# Altium schematic sheet DSP.SchDoc
size D
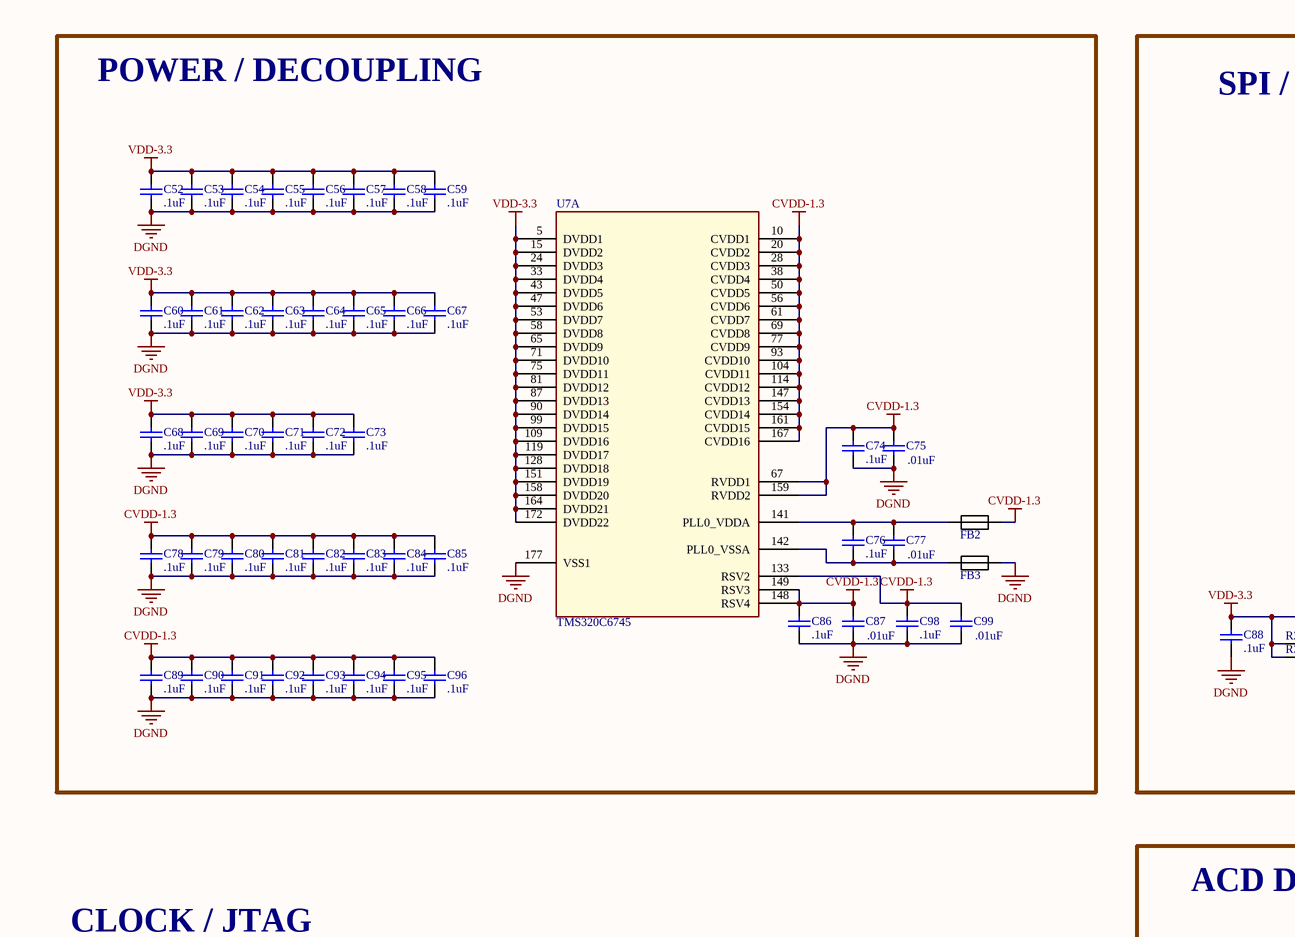
[diagram p0: DSP.SchDoc, top left]
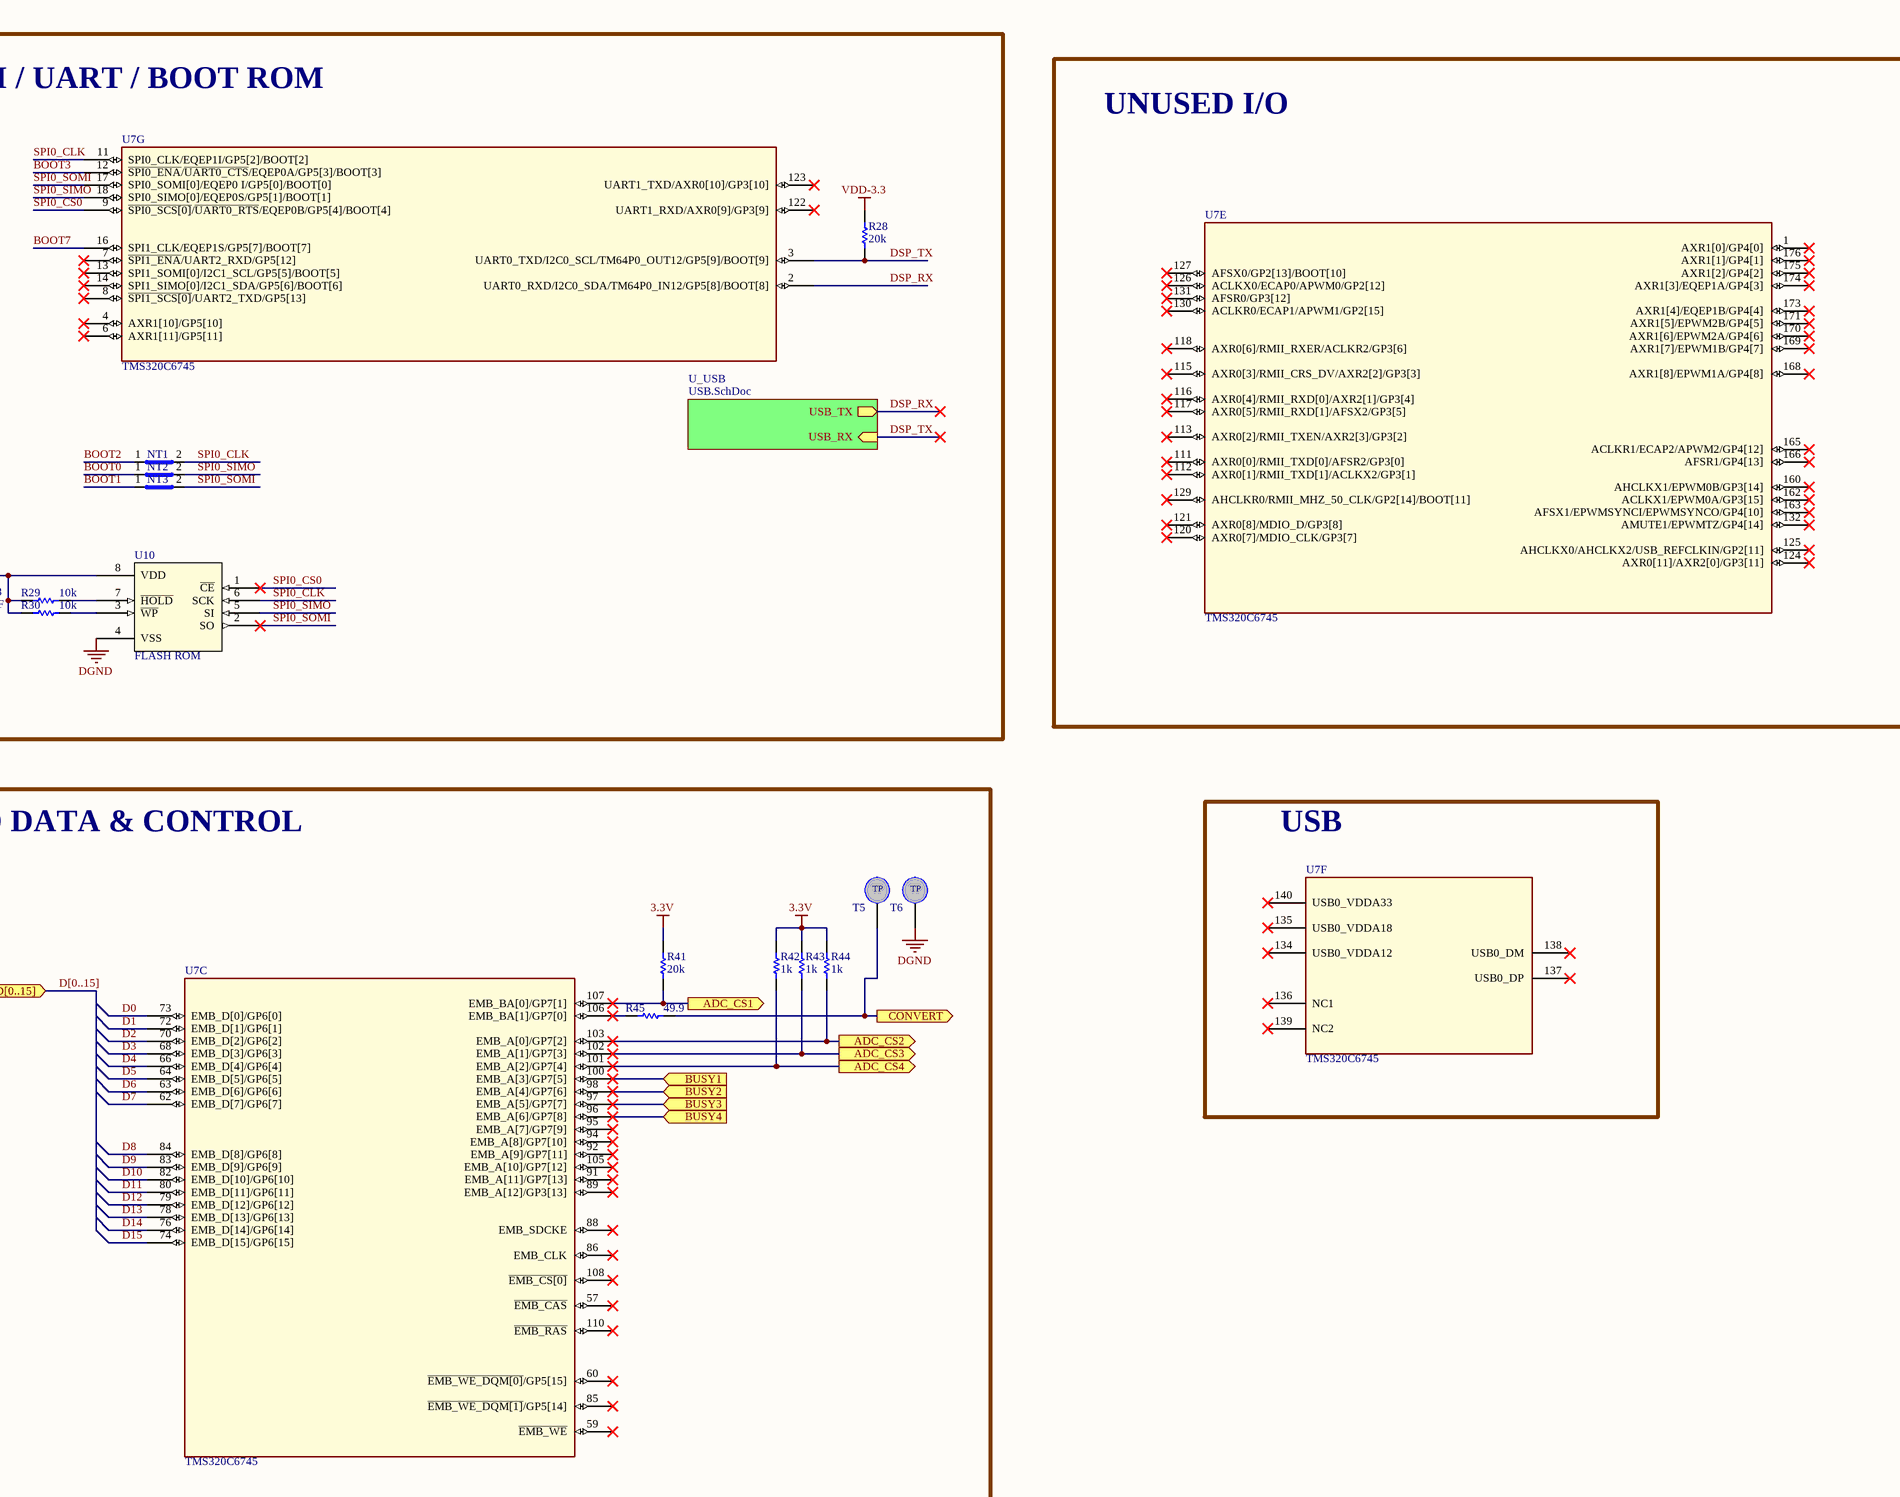
[diagram p1: DSP.SchDoc, top right]
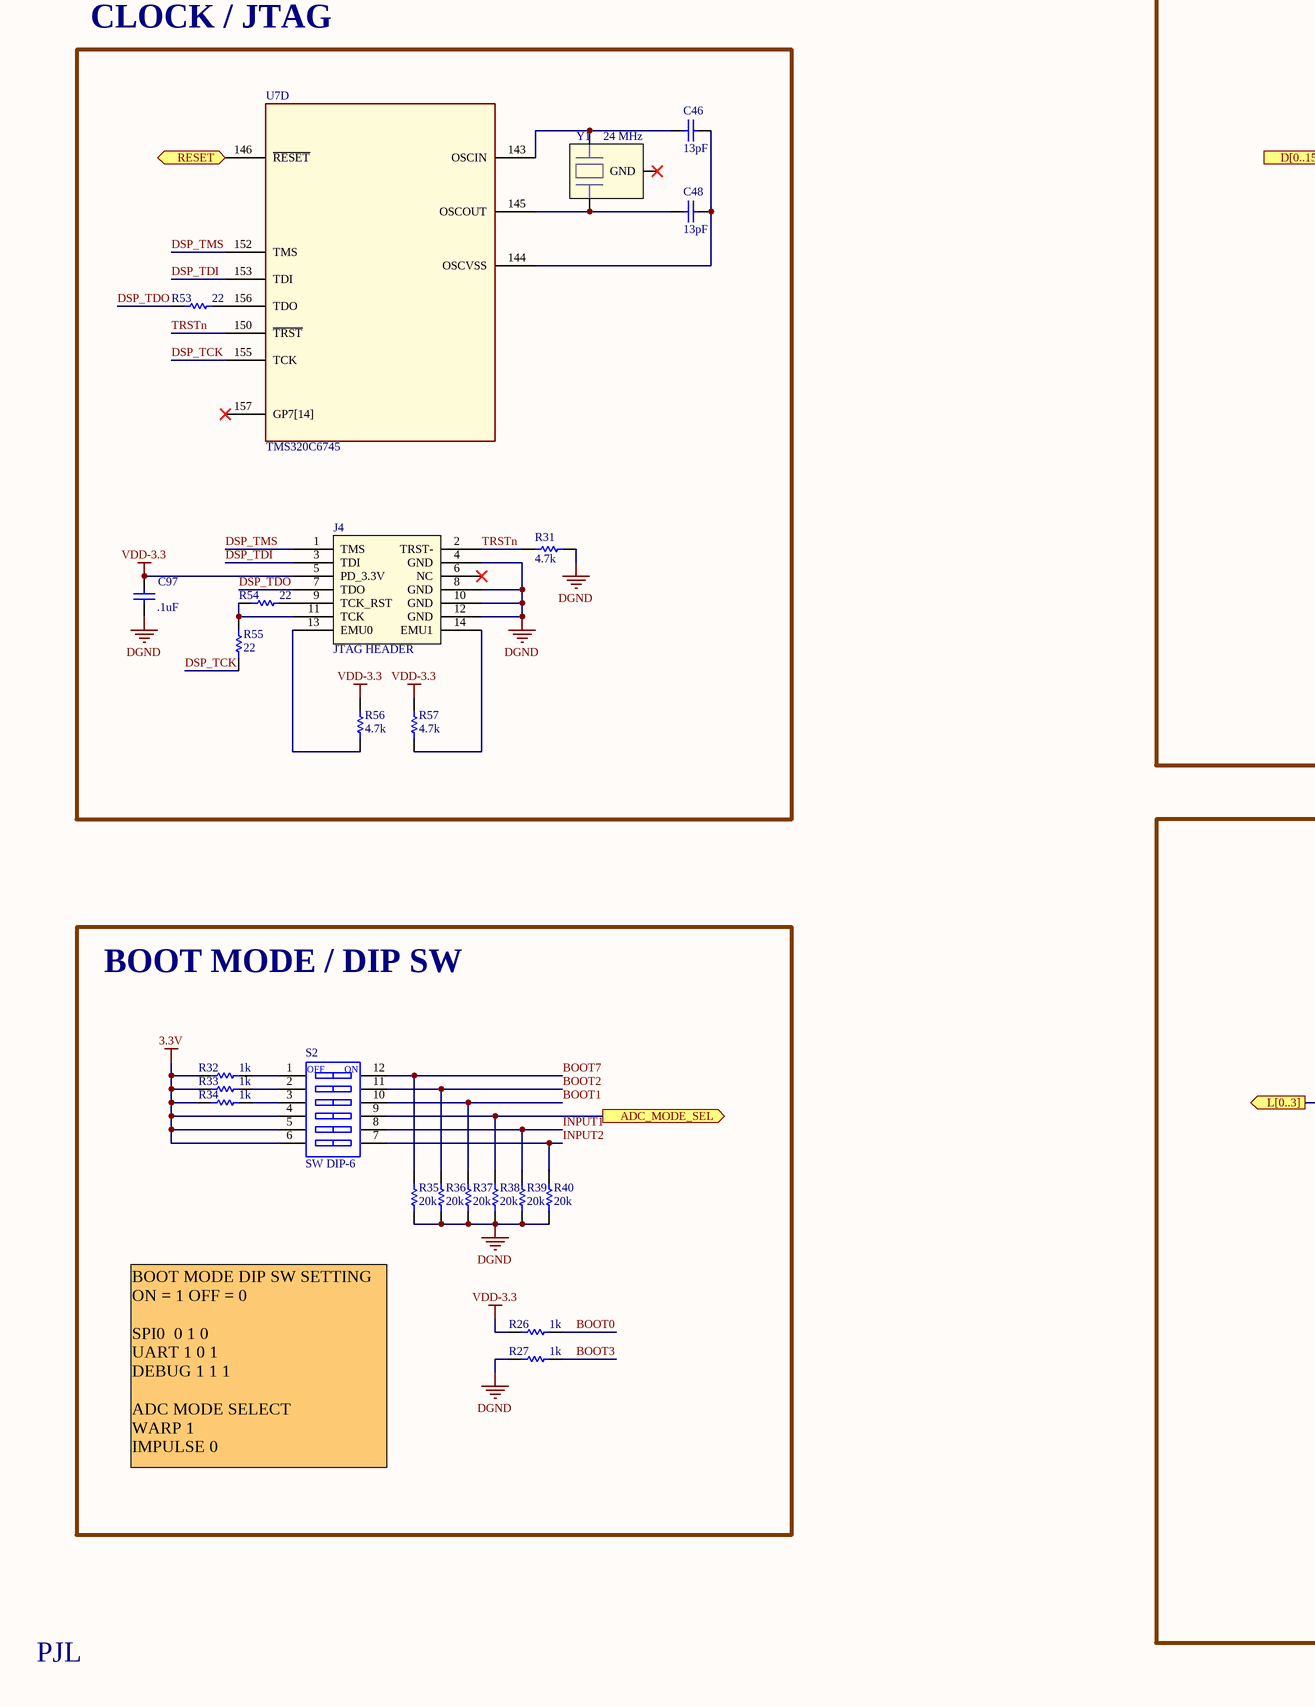
[diagram p2: DSP.SchDoc, bottom left]
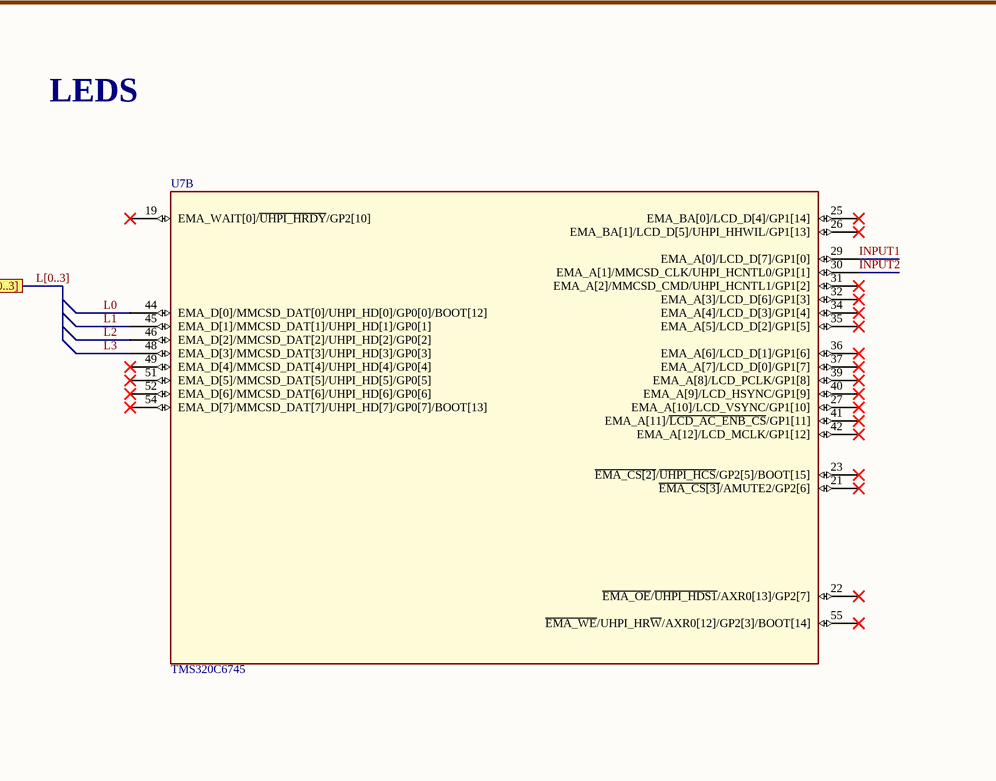
[diagram p3: DSP.SchDoc, bottom right]

## Parts
C46  13pF  [CAPC2012XL]
C48  13pF  [CAPC2012XL]
C52  .1uF  [CAPC1608XN]
C53  .1uF  [CAPC1608XN]
C54  .1uF  [CAPC1608XN]
C55  .1uF  [CAPC1608XN]
C56  .1uF  [CAPC1608XN]
C57  .1uF  [CAPC1608XN]
C58  .1uF  [CAPC1608XN]
C59  .1uF  [CAPC1608XN]
C60  .1uF  [CAPC1608XN]
C61  .1uF  [CAPC1608XN]
C62  .1uF  [CAPC1608XN]
C63  .1uF  [CAPC1608XN]
C64  .1uF  [CAPC1608XN]
C65  .1uF  [CAPC1608XN]
C66  .1uF  [CAPC1608XN]
C67  .1uF  [CAPC1608XN]
C68  .1uF  [CAPC1608XN]
C69  .1uF  [CAPC1608XN]
C70  .1uF  [CAPC1608XN]
C71  .1uF  [CAPC1608XN]
C72  .1uF  [CAPC1608XN]
C73  .1uF  [CAPC1608XN]
C74  .1uF  [CAPC1608XN]
C75  .01uF  [CAPC1608XN]
C76  .1uF  [CAPC1608XN]
C77  .01uF  [CAPC1608XN]
C78  .1uF  [CAPC1608XN]
C79  .1uF  [CAPC1608XN]
C80  .1uF  [CAPC1608XN]
C81  .1uF  [CAPC1608XN]
C82  .1uF  [CAPC1608XN]
C83  .1uF  [CAPC1608XN]
C84  .1uF  [CAPC1608XN]
C85  .1uF  [CAPC1608XN]
C86  .1uF  [CAPC1608XN]
C87  .01uF  [CAPC1608XN]
C88  .1uF  [CAPC1608XN]
C89  .1uF  [CAPC1608XN]
C90  .1uF  [CAPC1608XN]
C91  .1uF  [CAPC1608XN]
C92  .1uF  [CAPC1608XN]
C93  .1uF  [CAPC1608XN]
C94  .1uF  [CAPC1608XN]
C95  .1uF  [CAPC1608XN]
C96  .1uF  [CAPC1608XN]
C97  .1uF  [CAPC1608XN]
C98  .1uF  [CAPC1608XN]
C99  .01uF  [CAPC1608XN]
FB2  FERRITE 50  [RESC3116X06N/1206]  (value not drawn)
FB3  FERRITE 50  [RESC3116X06N/1206]  (value not drawn)
J4  JTAG HEADER  [JTAG HEADER - 14]
NT1  Net Tie SMT  [NetTie 10 mil]  (value not drawn)  (net tie, no BOM)
NT2  Net Tie SMT  [NetTie 10 mil]  (value not drawn)  (net tie, no BOM)
NT3  Net Tie SMT  [NetTie 10 mil]  (value not drawn)  (net tie, no BOM)
R26  1k  [RESC1608XL]
R27  1k  [RESC1608XL]
R28  20k  [RESC1608XL]
R29  10k  [RESC1608XL]
R30  10k  [RESC1608XL]
R31  4.7k  [RESC1608XL]
R32  1k  [RESC1608XL]
R33  1k  [RESC1608XL]
R34  1k  [RESC1608XL]
R35  20k  [RESC1608XL]
R36  20k  [RESC1608XL]
R37  20k  [RESC1608XL]
R38  20k  [RESC1608XL]
R39  20k  [RESC1608XL]
R40  20k  [RESC1608XL]
R41  20k  [RESC1608XL]
R42  1k  [RESC1608XL]
R43  1k  [RESC1608XL]
R44  1k  [RESC1608XL]
R45  49.9  [RESC1608XL]
R53  22  [RESC1608XL]
R54  22  [RESC1608XL]
R55  22  [RESC1608XL]
R56  4.7k  [RESC1608XL]
R57  4.7k  [RESC1608XL]
S2  SW DIP-6  [DIPSW-6]
T5  TEST  [KEYSTONE-TEST-POINT]  (value not drawn)
T6  TEST  [KEYSTONE-TEST-POINT]  (value not drawn)
U7  TMS320C6745  [PQFP-176N - TI]  (parts A,B,C,D,E,F,G of 7)
U10  FLASH ROM  [SOIC-8N]
Y1  24 MHz  [CTS405]

## Blocks framed on the sheet
POWER / DECOUPLING: C52-C87 C89-C96 C98 C99 FB2 FB3 U7
SPI / UART / BOOT ROM: C88 NT1-NT3 R28-R30 U7 U10
UNUSED I/O: U7
ACD DATA & CONTROL: R41-R45 T5 T6 U7
USB: U7
CLOCK / JTAG: C46 C48 C97 J4 R31 R53-R57 U7 Y1
LEDS: U7
BOOT MODE / DIP SW: R26 R27 R32-R40 S2

## Sub-sheets
U_USB = USB.SchDoc: USB_TX (out), USB_RX (in)

## Ports
ADC_CS1 (out), ADC_CS2 (out), ADC_CS3 (out), ADC_CS4 (out), ADC_MODE_SEL (out), BUSY1 (in), BUSY2 (in), BUSY3 (in), BUSY4 (in), CONVERT (out), D[0..15] (in), L[0..3] (out), RESET (in)

## Nets
3.3V: R32.1 R33.1 R34.1 R41.2 R42.2 R43.2 R44.2 S2.4(A4) S2.5(A5) S2.6(A6)
CVDD-1.3: C74.2 C75.2 C78.2 C79.2 C80.2 C81.2 C82.2 C83.2 C84.2 C85.2 C86.2 C87.2 C89.2 C90.2 C91.2 C92.2 C93.2 C94.2 C95.2 C96.2 C98.2 C99.2 FB2.2 U7.10(CVDD1) U7.20(CVDD2) U7.28(CVDD3) U7.38(CVDD4) U7.50(CVDD5) U7.56(CVDD6) U7.61(CVDD7) U7.67(RVDD1) U7.69(CVDD8) U7.77(CVDD9) U7.93(CVDD10) U7.104(CVDD11) U7.114(CVDD12) U7.133(RSV2) U7.147(CVDD13) U7.148(RSV4) U7.149(RSV3) U7.154(CVDD14) U7.159(RVDD2) U7.161(CVDD15) U7.167(CVDD16)
DGND: C52.1 C53.1 C54.1 C55.1 C56.1 C57.1 C58.1 C59.1 C60.1 C61.1 C62.1 C63.1 C64.1 C65.1 C66.1 C67.1 C68.1 C69.1 C70.1 C71.1 C72.1 C73.1 C74.1 C75.1 C78.1 C79.1 C80.1 C81.1 C82.1 C83.1 C84.1 C85.1 C86.1 C87.1 C88.1 C89.1 C90.1 C91.1 C92.1 C93.1 C94.1 C95.1 C96.1 C97.1 C98.1 C99.1 FB3.2 J4.4(GND) J4.8(GND) J4.10(GND) J4.12(GND) R27.2 R31.2 R35.2 R36.2 R37.2 R38.2 R39.2 R40.2 T6.1 U7.177(VSS1) U10.4(VSS)
VDD-3.3: C52.2 C53.2 C54.2 C55.2 C56.2 C57.2 C58.2 C59.2 C60.2 C61.2 C62.2 C63.2 C64.2 C65.2 C66.2 C67.2 C68.2 C69.2 C70.2 C71.2 C72.2 C73.2 C88.2 C97.2 J4.5(PD_3.3V) R26.2 R28.1 R29.2 R30.2 R56.1 R57.1 U7.5(DVDD1) U7.15(DVDD2) U7.24(DVDD3) U7.33(DVDD4) U7.43(DVDD5) U7.47(DVDD6) U7.53(DVDD7) U7.58(DVDD8) U7.65(DVDD9) U7.71(DVDD10) U7.75(DVDD11) U7.81(DVDD12) U7.87(DVDD13) U7.90(DVDD14) U7.99(DVDD15) U7.109(DVDD16) U7.119(DVDD17) U7.128(DVDD18) U7.151(DVDD19) U7.158(DVDD20) U7.164(DVDD21) U7.172(DVDD22) U10.8(VDD)
ADC_CS1: R41.1 U7.107(EMB_BA[0]/GP7[1]) ; port ADC_CS1
ADC_CS2: R44.1 U7.103(EMB_A[0]/GP7[2]) ; port ADC_CS2
ADC_CS3: R43.1 U7.102(EMB_A[1]/GP7[3]) ; port ADC_CS3
ADC_CS4: R42.1 U7.101(EMB_A[2]/GP7[4]) ; port ADC_CS4
ADC_MODE_SEL: R38.1 S2.9(B4) ; port ADC_MODE_SEL
BOOT0: NT2.1(Net1) R26.1
BOOT1: NT3.1(Net1) R37.1 S2.10(B3)
BOOT2: NT1.1(Net1) R36.1 S2.11(B2)
BOOT3: R27.1 U7.12(~{SPI0_ENA}/~{UART0_CTS}/EQEP0A/GP5[3]/BOOT[3])
BOOT7: R35.1 S2.12(B1) U7.16(SPI1_CLK/EQEP1S/GP5[7]/BOOT[7])
BUSY1: U7.100(EMB_A[3]/GP7[5]) ; port BUSY1
BUSY2: U7.98(EMB_A[4]/GP7[6]) ; port BUSY2
BUSY3: U7.97(EMB_A[5]/GP7[7]) ; port BUSY3
BUSY4: U7.96(EMB_A[6]/GP7[8]) ; port BUSY4
CONVERT: R45.1 T5.1 ; port CONVERT
D0: U7.73(EMB_D[0]/GP6[0])
D1: U7.72(EMB_D[1]/GP6[1])
D2: U7.70(EMB_D[2]/GP6[2])
D3: U7.68(EMB_D[3]/GP6[3])
D4: U7.66(EMB_D[4]/GP6[4])
D5: U7.64(EMB_D[5]/GP6[5])
D6: U7.63(EMB_D[6]/GP6[6])
D7: U7.62(EMB_D[7]/GP6[7])
D8: U7.84(EMB_D[8]/GP6[8])
D9: U7.83(EMB_D[9]/GP6[9])
D10: U7.82(EMB_D[10]/GP6[10])
D11: U7.80(EMB_D[11]/GP6[11])
D12: U7.79(EMB_D[12]/GP6[12])
D13: U7.78(EMB_D[13]/GP6[13])
D14: U7.76(EMB_D[14]/GP6[14])
D15: U7.74(EMB_D[15]/GP6[15])
DSP_RX: U7.2(UART0_RXD/I2C0_SDA/TM64P0_IN12/GP5[8]/BOOT[8]) ; sheet U_USB/USB_TX
DSP_TCK: R55.1 U7.155(TCK)
DSP_TDI: J4.3(TDI) U7.153(TDI)
DSP_TDO: J4.7(TDO) R53.2
DSP_TMS: J4.1(TMS) U7.152(TMS)
DSP_TX: R28.2 U7.3(UART0_TXD/I2C0_SCL/TM64P0_OUT12/GP5[9]/BOOT[9]) ; sheet U_USB/USB_RX
INPUT1: R39.1 S2.8(B5) U7.29(EMA_A[0]/LCD_D[7]/GP1[0])
INPUT2: R40.1 S2.7(B6) U7.30(EMA_A[1]/MMCSD_CLK/UHPI_HCNTL0/GP1[1])
L0: U7.44(EMA_D[0]/MMCSD_DAT[0]/UHPI_HD[0]/GP0[0]/BOOT[12])
L1: U7.45(EMA_D[1]/MMCSD_DAT[1]/UHPI_HD[1]/GP0[1])
L2: U7.46(EMA_D[2]/MMCSD_DAT[2]/UHPI_HD[2]/GP0[2])
L3: U7.48(EMA_D[3]/MMCSD_DAT[3]/UHPI_HD[3]/GP0[3])
RESET: U7.146(~{RESET}) ; port RESET
SPI0_CLK: NT1.2(Net2) U7.11(SPI0_CLK/EQEP1I/GP5[2]/BOOT[2]) U10.6(SCK)
SPI0_CS0: U7.9(~{SPI0_SCS[0]}/~{UART0_RTS}/EQEP0B/GP5[4]/BOOT[4]) U10.1(~{CE})
SPI0_SIMO: NT2.2(Net2) U7.18(SPI0_SIMO[0]/EQEP0S/GP5[1]/BOOT[1]) U10.5(SI)
SPI0_SOMI: NT3.2(Net2) U7.17(SPI0_SOMI[0]/EQEP0_I/GP5[0]/BOOT[0]) U10.2(SO)
TRSTn: J4.2(TRST-) R31.1 U7.150(~{TRST})
NetC46_1: C46.1 C48.1 U7.144(OSCVSS)
NetC46_2: C46.2 U7.143(OSCIN) Y1.1
NetC48_2: C48.2 U7.145(OSCOUT) Y1.3
NetC76_1: C76.1 C77.1 FB3.1 U7.142(PLL0_VSSA)
NetC76_2: C76.2 C77.2 FB2.1 U7.141(PLL0_VDDA)
NetJ4_9: J4.9(TCK_RST) R54.2
NetJ4_11: J4.11(TCK) R54.1 R55.2
NetJ4_13: J4.13(EMU0) R56.2
NetJ4_14: J4.14(EMU1) R57.2
NetR29_1: R29.1 U10.7(~{HOLD})
NetR30_1: R30.1 U10.3(~{WP})
NetR32_2: R32.2 S2.1(A1)
NetR33_2: R33.2 S2.2(A2)
NetR34_2: R34.2 S2.3(A3)
NetR45_2: R45.2 U7.106(EMB_BA[1]/GP7[0])
NetR53_1: R53.1 U7.156(TDO)

Not connected (* = marked no-connect by the designer): J4 6(NC)*; U7 1(AXR1[0]/GP4[0])* 4(AXR1[10]/GP5[10])* 6(AXR1[11]/GP5[11])* 7(~{SPI1_ENA}/UART2_RXD/GP5[12])* 8(~{SPI1_SCS[0]}/UART2_TXD/GP5[13])* 13(SPI1_SOMI[0]/I2C1_SCL/GP5[5]/BOOT[5])* 14(SPI1_SIMO[0]/I2C1_SDA/GP5[6]/BOOT[6])* 19(EMA_WAIT[0]/~{UHPI_HRDY}/GP2[10])* 21(~{EMA_CS[3]}/AMUTE2/GP2[6])* 22(~{EMA_OE}/~{UHPI_HDS1}/AXR0[13]/GP2[7])* 23(~{EMA_CS[2]}/~{UHPI_HCS}/GP2[5]/BOOT[15])* 25(EMA_BA[0]/LCD_D[4]/GP1[14])* 26(EMA_BA[1]/LCD_D[5]/UHPI_HHWIL/GP1[13])* 27(EMA_A[10]/LCD_VSYNC/GP1[10])* 31(EMA_A[2]/MMCSD_CMD/UHPI_HCNTL1/GP1[2])* 32(EMA_A[3]/LCD_D[6]/GP1[3])* 34(EMA_A[4]/LCD_D[3]/GP1[4])* 35(EMA_A[5]/LCD_D[2]/GP1[5])* 36(EMA_A[6]/LCD_D[1]/GP1[6])* 37(EMA_A[7]/LCD_D[0]/GP1[7])* 39(EMA_A[8]/LCD_PCLK/GP1[8])* 40(EMA_A[9]/LCD_HSYNC/GP1[9])* 41(EMA_A[11]/~{LCD_AC_ENB_CS}/GP1[11])* 42(EMA_A[12]/LCD_MCLK/GP1[12])* 49(EMA_D[4]/MMCSD_DAT[4]/UHPI_HD[4]/GP0[4])* 51(EMA_D[5]/MMCSD_DAT[5]/UHPI_HD[5]/GP0[5])* 52(EMA_D[6]/MMCSD_DAT[6]/UHPI_HD[6]/GP0[6])* 54(EMA_D[7]/MMCSD_DAT[7]/UHPI_HD[7]/GP0[7]/BOOT[13])* 55(~{EMA_WE}/UHPI_HR~{W}/AXR0[12]/GP2[3]/BOOT[14])* 57(~{EMB_CAS})* 59(~{EMB_WE})* 60(~{EMB_WE_DQM[0]}/GP5[15])* 85(~{EMB_WE_DQM[1]}/GP5[14])* 86(EMB_CLK)* 88(EMB_SDCKE)* 89(EMB_A[12]/GP3[13])* 91(EMB_A[11]/GP7[13])* 92(EMB_A[9]/GP7[11])* 94(EMB_A[8]/GP7[10])* 95(EMB_A[7]/GP7[9])* 105(EMB_A[10]/GP7[12])* 108(~{EMB_CS[0]})* 110(~{EMB_RAS})* 111(AXR0[0]/RMII_TXD[0]/AFSR2/GP3[0])* 112(AXR0[1]/RMII_TXD[1]/ACLKX2/GP3[1])* 113(AXR0[2]/RMII_TXEN/AXR2[3]/GP3[2])* 115(AXR0[3]/RMII_CRS_DV/AXR2[2]/GP3[3])* 116(AXR0[4]/RMII_RXD[0]/AXR2[1]/GP3[4])* 117(AXR0[5]/RMII_RXD[1]/AFSX2/GP3[5])* 118(AXR0[6]/RMII_RXER/ACLKR2/GP3[6])* 120(AXR0[7]/MDIO_CLK/GP3[7])* 121(AXR0[8]/MDIO_D/GP3[8])* 122(UART1_RXD/AXR0[9]/GP3[9])* 123(UART1_TXD/AXR0[10]/GP3[10])* 124(AXR0[11]/AXR2[0]/GP3[11])* 125(AHCLKX0/AHCLKX2/USB_REFCLKIN/GP2[11])* 126(ACLKX0/ECAP0/APWM0/GP2[12])* 127(AFSX0/GP2[13]/BOOT[10])* 129(AHCLKR0/RMII_MHZ_50_CLK/GP2[14]/BOOT[11])* 130(ACLKR0/ECAP1/APWM1/GP2[15])* 131(AFSR0/GP3[12])* 132(AMUTE1/EPWMTZ/GP4[14])* 134(USB0_VDDA12)* 135(USB0_VDDA18)* 136(NC1)* 137(USB0_DP)* 138(USB0_DM)* 139(NC2)* 140(USB0_VDDA33)* 157(GP7[14])* 160(AHCLKX1/EPWM0B/GP3[14])* 162(ACLKX1/EPWM0A/GP3[15])* 163(AFSX1/EPWMSYNCI/EPWMSYNCO/GP4[10])* 165(ACLKR1/ECAP2/APWM2/GP4[12])* 166(AFSR1/GP4[13])* 168(AXR1[8]/EPWM1A/GP4[8])* 169(AXR1[7]/EPWM1B/GP4[7])* 170(AXR1[6]/EPWM2A/GP4[6])* 171(AXR1[5]/EPWM2B/GP4[5])* 173(AXR1[4]/EQEP1B/GP4[4])* 174(AXR1[3]/EQEP1A/GP4[3])* 175(AXR1[2]/GP4[2])* 176(AXR1[1]/GP4[1])*; Y1 2,4(GND)*

## Buses and harness runs
bus D[0..15] = port D[0..15]
bus L[0..3] = port L[0..3]

## Notes on the sheet
- BOOT MODE DIP SW SETTING
  ON = 1	OFF = 0
  SPI0 	0 1 0
  UART	1 0 1
  DEBUG	1 1 1
  ADC MODE SELECT
  WARP	1
  IMPULSE	0
- PJL
- (in symbol SW DIP-6) OFF; ON
- (in symbol TEST-POINT) TP

## Library data of the parts
C46 C48 = CAP-CERAMIC-NP: CAP CER 10UF 10V 10% X7R 0805; Manufacturer: Murata Electronics North America; Manufacturer Part Number: GRM1885C1H130JA01D; Tolerance: ±5%; Description: CAP CER 13PF 50V 5% NP0 0603; Voltage - Rated: 50V; Temperature Coefficient: C0G, NP0; Operating Temperature: -55°C ~ 125°C; Capacitance: 13pF; Supplier Part Number: 490-1406-1-ND; Supplier: Digi-Key; Package / Case: 0603 (1608 Metric)
C52-C74 C76 C78-C86 C88-C98 = CAP-CERAMIC-NP: CAP CER 0.1UF 10V 20% X7R 0603; Manufacturer Part Number: CX0603MRX7R6BB104; Manufacturer: Yageo; Capacitance: 0.1µF; Applications: Bypass, Decoupling; Operating Temperature: -55°C ~ 125°C; Tolerance: ±20%; Package / Case: 0603 (1608 Metric); Voltage - Rated: 10V; Temperature Coefficient: X7R; Supplier Part Number: 311-1237-1-ND; Supplier: Digi-Key
C75 C77 C87 C99 = Capacitor: CAP CER 10000PF 16V 10% X7R 0603; Manufacturer Part Number: GRM188R71C103KA01D; Manufacturer: Murata Electronics North America; Package / Case: 0603 (1608 Metric); Voltage - Rated: 16V; Capacitance: 10000pF; Temperature Coefficient: X7R; Tolerance: ±10%; Supplier: Digi-Key; Supplier Part Number: 490-1525-1-ND
FB2 FB3 = FERRITE: FERRITE BEAD 60 OHM 3.0A 0805; Manufacturer: Murata Electronics North America; Manufacturer Part Number: BLM31PG500SN1L; Description: FERRITE CHIP 50 OHM 3000MA 1206; Filter Type: Differential Mode - Single; Impedance @ Frequency: 50 Ohm @ 100MHz; Current Rating: 3A; Supplier: Digi-Key; Supplier Part Number: 490-1055-1-ND; Package / Case: 1206 (3216 Metric)
J4 = JTAG-TI_14: 14 Pin JTAG Header
NT1-NT3 = NetTie: Net-Tie, Surface Mount
R26 R27 R32-R34 R42-R44 = RES-CHIP: Resistor Chip; Manufacturer: Yageo; Manufacturer Part Number: RC0603JR-071KL; Description: RES 1.0K OHM 1/10W 5% 0603 SMD; Tolerance: ±5%; Power (Watts): 0.1W, 1/10W; Supplier Part Number: 311-1.0KGRCT-ND; Supplier: Digi-Key; Package / Case: 0603 (1608 Metric); Resistance (Ohms): 1k
R28 R35-R41 = RES-CHIP: Resistor Chip; Manufacturer Part Number: RC0603JR-0720KL; Manufacturer: Yageo; Tolerance: ±5%; Power (Watts): 0.1W, 1/10W; Description: RES 20K OHM 1/10W 5% 0603 SMD; Package / Case: 0603 (1608 Metric); Supplier: Digi-Key; Supplier Part Number: 311-20KGRCT-ND; Resistance (Ohms): 20k
R29 R30 = RES-CHIP: Resistor Chip; Manufacturer: Yageo; Manufacturer Part Number: RC0603JR-0710KL; Description: RES 10K OHM 1/10W 5% 0603 SMD; Tolerance: ±5%; Power (Watts): 0.1W, 1/10W; Supplier Part Number: 311-10KGRCT-ND; Supplier: Digi-Key; Package / Case: 0603 (1608 Metric); Resistance (Ohms): 10k
R31 R56 R57 = RES-CHIP: Resistor Chip; Manufacturer: Yageo; Manufacturer Part Number: RC0603JR-074K7L; Tolerance: ±5%; Power (Watts): 0.1W, 1/10W; Description: RES 4.7K OHM 1/10W 5% 0603 SMD; Resistance (Ohms): 4.7k; Package / Case: 0603 (1608 Metric); Supplier: Digi-Key; Supplier Part Number: 311-4.7KGRDKR-ND
R45 = RES-CHIP: Resistor Chip; Manufacturer: Yageo; Manufacturer Part Number: RC0603FR-0749R9L; Power (Watts): 0.1W, 1/10W; Description: RES 49.9 OHM 1/10W 1% 0603 SMD; Tolerance: ±1%; Supplier: Digi-Key; Package / Case: 0603 (1608 Metric); Supplier Part Number: 311-49.9HRCT-ND; Resistance (Ohms): 49.9
R53-R55 = RES-CHIP: Resistor Chip; Manufacturer Part Number: RC0603FR-0722RL; Manufacturer: Yageo; Tolerance: ±1%; Power (Watts): 0.1W, 1/10W; Description: RES 22.0 OHM 1/10W 1% 0603 SMD; Package / Case: 0603 (1608 Metric); Supplier Part Number: 311-22.0HRCT-ND; Resistance (Ohms): 22; Supplier: Digi-Key
S2 = SW DIP-6: SWITCH DIP 6POS HALF PITCH SMD; Manufacturer: C&K Components; Manufacturer Part Number: TDA06H0SB1R; Contact Rating @ Voltage: 0.025A @ 24VDC; Number of Positions: 6; Circuit: SPST; Actuator Level: Flush; Supplier: Digi-Key; Supplier Part Number: CKN9503CT-ND
T5 T6 = TEST-POINT: Single pin, looped test point --- 0.063" (1.600mm) Hole Diameter; Manufacturer Part Number: 5006; Manufacturer: Keystone Electronics; Color: Black; Description: TEST POINT PC COMPACT .063"D BLK; Mounting Type: 0.063" (1.60mm) Hole Diameter; Supplier: Digi-Key; Supplier Part Number: 5006K-ND
U7 = TMS320C6745: IC DSP FIX/FLOAT POINT 176HLQFP; Manufacturer Part Number: TMS320C6745CPTP4; Manufacturer: Texas Instruments; Voltage - Core: 1.20V; On-Chip RAM: 320kB; Voltage - I/O: 3.30V; Clock Rate: 456MHz; SlotXofY: SYM 7 OF 7; Supplier: Digi-Key; Type: Fixed/Floating Point; Package / Case: 176-LQFP Exposed Pad; SymName: TMS320C6745; Supplier Part Number: 296-30152-5-ND
U10 = Memory - SPI 32M Flash: IC FLASH SER 32M 80MHZ SPI 8SOIC; Manufacturer Part Number: SST25VF032B-80-4I-S2AF; Manufacturer: Microchip Technology; Voltage - Supply: 2.7 V ~ 3.6 V; Memory Size: 32M (4M x 8); Interface: SPI Serial; Memory Type: FLASH; Supplier: Digi-Key; Package / Case: 8-SOIC (0.209", 5.30mm Width); Supplier Part Number: SST25VF032B-80-4I-S2AF-ND
Y1 = CTS405 25MHz Crystal: CRYSTAL 24.0 MHZ 13PF SMD; Manufacturer Part Number: 405C35B24M00000; Manufacturer: CTS-Frequency Controls; Description: CRYSTAL 24.000000 MHZ 13PF SMD; ESR (Equivalent Series Resistance): 50 Ohm; Frequency: 24MHz; Supplier: Digi-Key; Load Capacitance: 13pF; Supplier Part Number: CTX651CT-ND